# EAGLE design usbprog_v3_3 (EAGLE 5.11)
OC_FARNELL: unknown
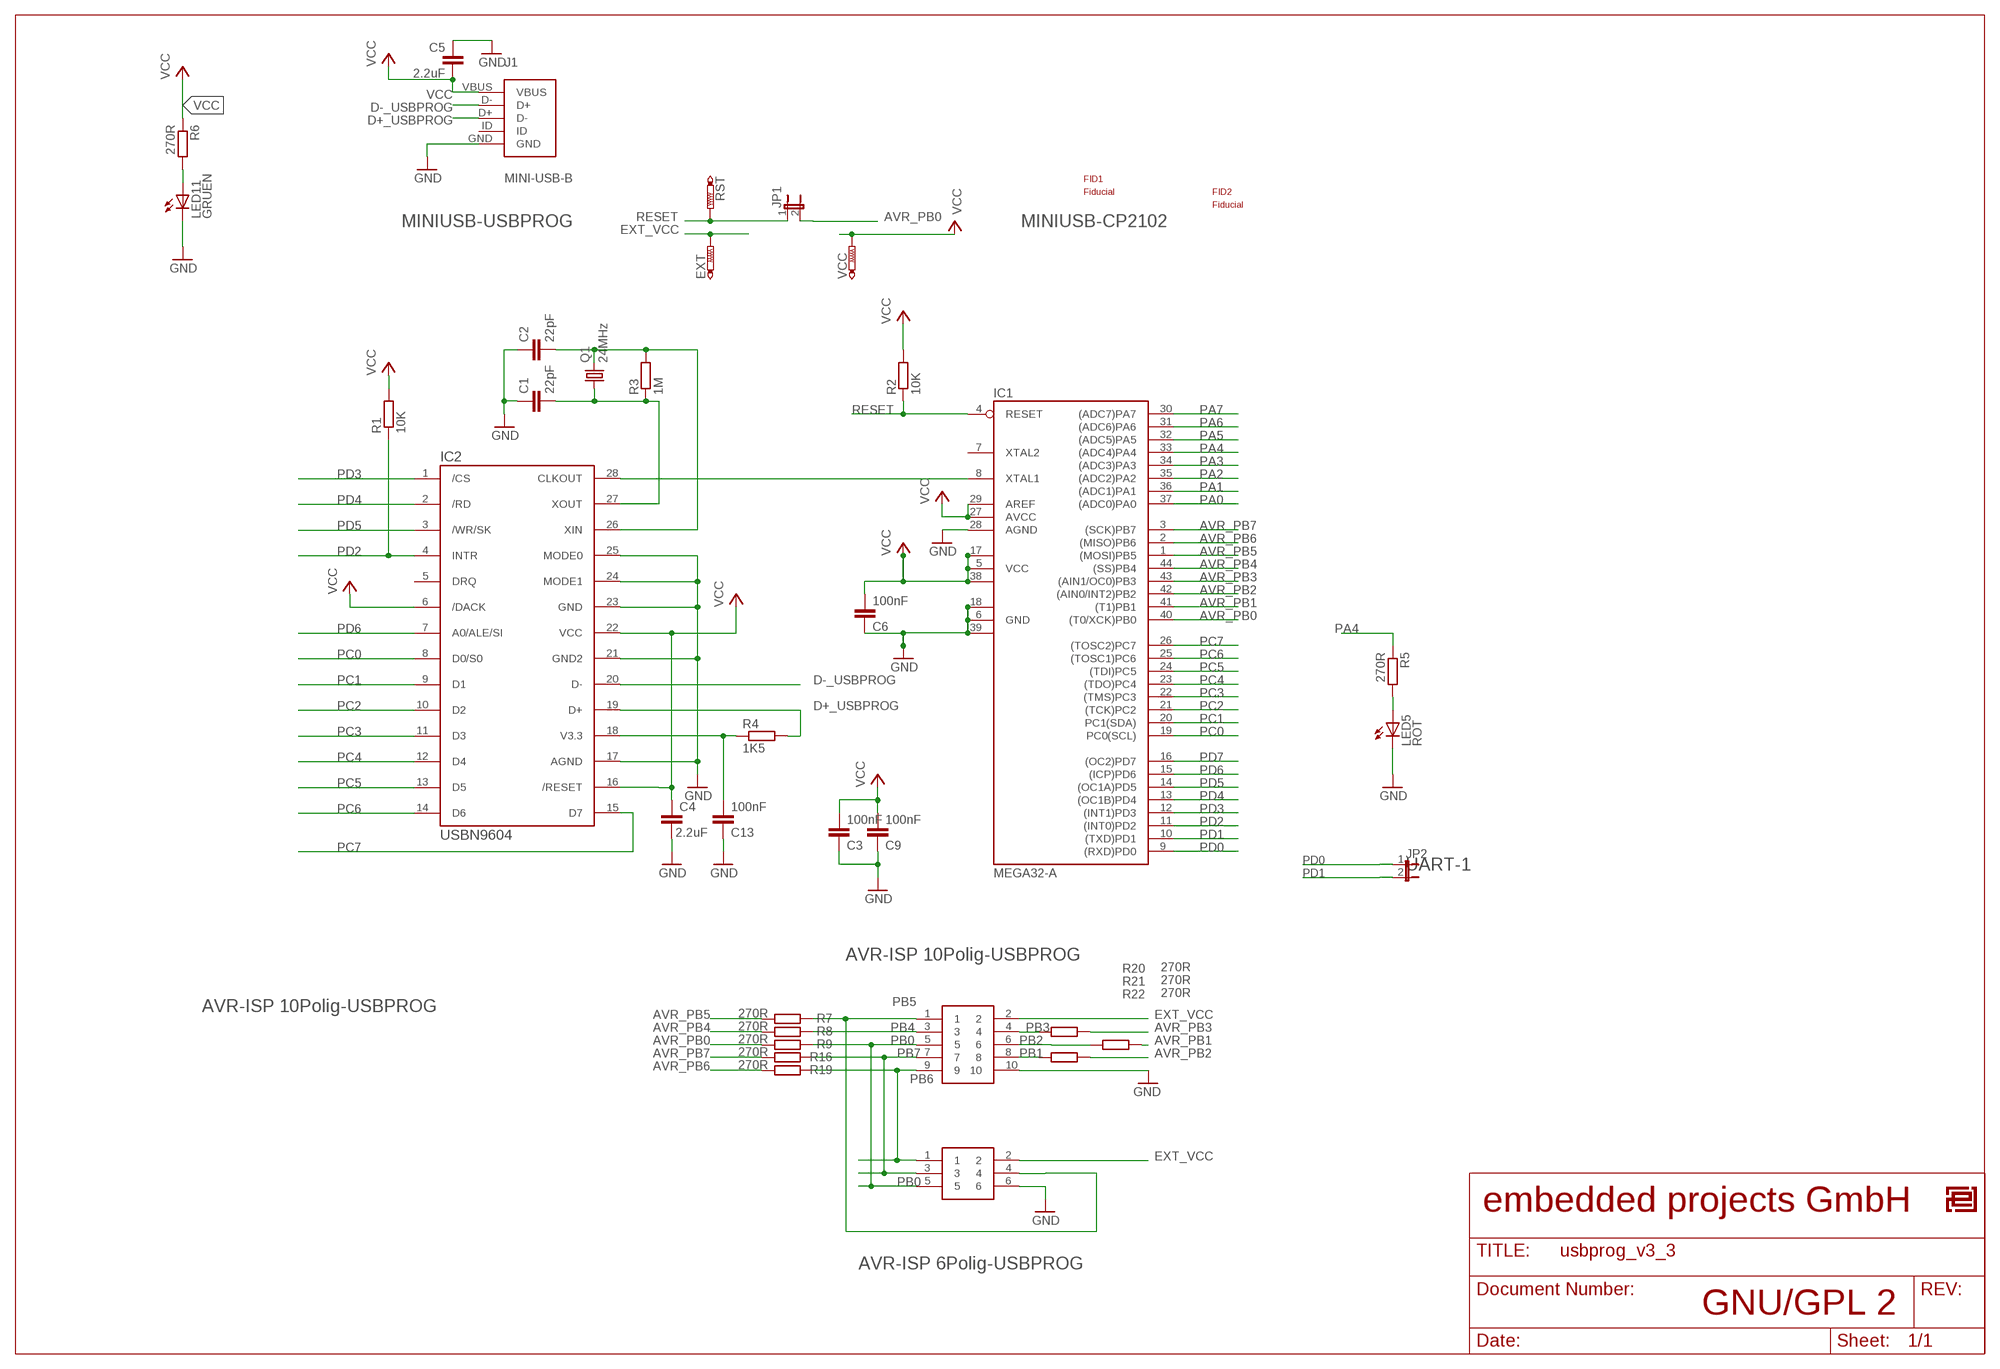
[diagram p0: schematic, sheet 1]

## Parts
C1  22pF  C-EUC0805  [C0805]
C2  22pF  C-EUC0805  [C0805]
C3  100nF  C-EUC0805  [C0805]
C4  2.2uF  C-EUC0805  [C0805]
C5  2.2uF  C-EUC0805  [C0805]
C6  100nF  C-EUC0805  [C0805]
C9  100nF  C-EUC0805  [C0805]
C13  100nF  C-EUC0805  [C0805]
EXT  PTR1TP08R  [TP08R]
FID1  PASSERMARKEN_FIDUCIAL  [PASSERMARKEN_FIDUCIAL]
FID2  PASSERMARKEN_FIDUCIAL  [PASSERMARKEN_FIDUCIAL]
IC1  MEGA32-A  [TQFP44]
IC2  USBN9604  [SO28-3]
J1  MINI-USB-B  [MINI-USB-B]
JP1  JP1E  [JP1]
JP2  JP1E  [JP1]
LED5  ROT  LEDCHIPLED_0805  [CHIPLED_0805]
LED11  GRUEN  LEDCHIPLED_0805  [CHIPLED_0805]
Q1  24MHz  CRYSTALSMD  [HC49UP]
R1  10K  R-EU_R0805  [R0805]
R2  10K  R-EU_R0805  [R0805]
R3  1M  R-EU_R0805  [R0805]
R4  1K5  R-EU_M0805  [M0805]
R5  270R  R-EU_R0805  [R0805]
R6  270R  R-EU_R0805  [R0805]
R7  270R  R-EU_R0805  [R0805]
R8  270R  R-EU_R0805  [R0805]
R9  270R  R-EU_R0805  [R0805]
R16  270R  R-EU_R0805  [R0805]
R19  270R  R-EU_R0805  [R0805]
R20  270R  R-EU_R0805  [R0805]
R21  270R  R-EU_R0805  [R0805]
R22  270R  R-EU_R0805  [R0805]
RST  PTR1TP15R  [TP15R]
U$1  EPLOGO  [EPLOGOKUPFER]
VCC  PTR1TP08R  [TP08R]
Y1  DNP  HEADER2X5  [CON-3M_PAK100/2500-10]
Y2  DNP  HEADER2X3  [PINHEADER2X3_PINHEADER3X2]

## Nets
AVR_PB0: IC1.40((T0/XCK)PB0) JP1.2 R9.2
AVR_PB1: IC1.41((T1)PB1) R21.2
AVR_PB2: IC1.42((AIN0/INT2)PB2) R22.2
AVR_PB3: IC1.43((AIN1/OC0)PB3) R20.2
AVR_PB4: IC1.44((SS)PB4) R8.2
AVR_PB5: IC1.1((MOSI)PB5) R7.2
AVR_PB6: IC1.2((MISO)PB6) R19.2
AVR_PB7: IC1.3((SCK)PB7) R16.2
D+_USBPROG: IC2.19(D+) J1.D+(D-) R4.2
D-_USBPROG: IC2.20(D-) J1.D-(D+)
EXT_VCC [500mA]: EXT.TP Y1.2 Y2.2
GND: C1.1 C2.1 C3.1 C4.2 C5.1 C6.1 C9.1 C13.1 IC1.6(GND) IC1.18(GND1) IC1.28(AGND) IC1.39(GND2) IC2.17(AGND) IC2.21(GND2) IC2.23(GND) IC2.24(MODE1) IC2.25(MODE0) J1.GND LED5.C LED11.C Y1.10 Y2.6
N$6: IC1.8(XTAL1) IC2.28(CLKOUT)
N$7: C13.2 IC2.18(V3.3) R4.1
N$8: C2.2 IC2.26(XIN) Q1.2 R3.2
N$9: LED5.A R5.2
N$10: LED11.A R6.2
N$11: C1.2 IC2.27(XOUT) Q1.1 R3.1
PA0: IC1.37((ADC0)PA0)
PA1: IC1.36((ADC1)PA1)
PA2: IC1.35((ADC2)PA2)
PA3: IC1.34((ADC3)PA3)
PA4: IC1.33((ADC4)PA4) R5.1
PA5: IC1.32((ADC5)PA5)
PA6: IC1.31((ADC6)PA6)
PA7: IC1.30((ADC7)PA7)
PB0: R9.1 Y1.5 Y2.5
PB1: R22.1 Y1.8
PB2: R21.1 Y1.6
PB3: R20.1 Y1.4
PB4: R8.1 Y1.3
PB5: R7.1 Y1.1 Y2.4
PB6: R19.1 Y1.9 Y2.1
PB7: R16.1 Y1.7 Y2.3
PC0: IC1.19(PC0(SCL)) IC2.8(D0/S0)
PC1: IC1.20(PC1(SDA)) IC2.9(D1)
PC2: IC1.21((TCK)PC2) IC2.10(D2)
PC3: IC1.22((TMS)PC3) IC2.11(D3)
PC4: IC1.23((TDO)PC4) IC2.12(D4)
PC5: IC1.24((TDI)PC5) IC2.13(D5)
PC6: IC1.25((TOSC1)PC6) IC2.14(D6)
PC7: IC1.26((TOSC2)PC7) IC2.15(D7)
PD0: IC1.9((RXD)PD0) JP2.1
PD1: IC1.10((TXD)PD1) JP2.2
PD2: IC1.11((INT0)PD2) IC2.4(INTR) R1.1
PD3: IC1.12((INT1)PD3) IC2.1(/CS)
PD4: IC1.13((OC1B)PD4) IC2.2(/RD)
PD5: IC1.14((OC1A)PD5) IC2.3(/WR/SK)
PD6: IC1.15((ICP)PD6) IC2.7(A0/ALE/SI)
PD7: IC1.16((OC2)PD7)
RESET: IC1.4(RESET) JP1.1 R2.1 RST.TP
VCC [500mA]: C3.2 C4.1 C5.2 C6.2 C9.2 IC1.5(VCC) IC1.17(VCC1) IC1.27(AVCC) IC1.29(AREF) IC1.38(VCC2) IC2.6(/DACK) IC2.16(/RESET) IC2.22(VCC) J1.VBUS R1.2 R2.2 R6.1 VCC.TP
Unconnected: IC1.7(XTAL2) IC2.5(DRQ) J1.ID

## Notes on the sheet
- MINIUSB-CP2102
- MINIUSB-USBPROG
- UART-1
- AVR-ISP 10Polig-USBPROG
- AVR-ISP 10Polig-USBPROG
- embedded projects GmbH
- AVR-ISP 6Polig-USBPROG
- GNU/GPL 2

## Library data of the parts
C1 C2 C4 C5 = rcl:C-EU: CAPACITOR, European symbol
C3 C6 C9 C13 = resistor:C-EU: CAPACITOR, European symbol
EXT RST VCC = testpad:PTR1: TEST PIN
FID1 FID2 = PASSERMARKER:PASSERMARKEN_FIDUCIAL: SMD Passermarke
IC1 = avr:MEGA32: MICROCONTROLLER 32 Kbytes FLASH 2 Kbytes SRAM 1 Kbytes EEPROM USART 8-channel 10 bit ADC
IC2 = bene:USBN9604
J1 = mini-usb-b:MINI-USB-B
JP1 JP2 = jumper:JP1E: JUMPER
LED5 LED11 = led:LED: LED OSRAM: - CHIPLED LG R971, LG N971, LY N971, LG Q971, LY Q971, LO R971, LY R971 LH N974, LH R974 LS Q976, LO Q976, LY Q976 LO Q996 - Hyper CHIPLED LW Q18S LB Q993, LB Q99A, LB R99A - SideLED LS A670, LO A670, LY A670, LG A670, LP A670 LB A673, LV A673, LT A673, LW A673 LH A674 LY A675 LS A676, LA A676, LO A676, LY A676, LW A676 LS A679, LY A679, LG A679 - Hyper Micro SIDELED® LS Y876, LA Y876, LO Y876, LY Y876 LT Y87S - SmartLED LW L88C, LW L88S LB L89C, LB L89S, LG L890 LS L89K, LO L89K, LY L89K LS L896, LA L896, LO L896, LY L896 - TOPLED LS T670, LO T670, LY T670, LG T670, LP T670 LSG T670, LSP T670, LSY T670, LOP T670, LYG T670 LG T671, LOG T671, LSG T671 LB T673, LV T673, LT T673, LW T673 LH T674 LS T676, LA T676, LO T676, LY T676, LB T676, LH T676, LSB T676, LW T676 LB T67C, LV T67C, LT T67C, LS T67K, LO T67K, LY T67K, LW E67C LS E67B, LA E67B, LO E67B, LY E67B, LB E67C, LV E67C, LT E67C LW T67C LS T679, LY T679, LG T679 LS T770, LO T770, LY T770, LG T770, LP T770 LB T773, LV T773, LT T773, LW T773 LH T774 LS E675, LA E675, LY E675, LS T675 LS T776, LA T776, LO T776, LY T776, LB T776 LHGB T686 LT T68C, LB T68C - Hyper Mini TOPLED® LB M676 - Mini TOPLED Santana® LG M470 LS M47K, LO M47K, LY M47K Source: http://www.osram.convergy.de LUXEON: - LUMILED® LXK2-PW12-R00, LXK2-PW12-S00, LXK2-PW14-U00, LXK2-PW14-V00 LXK2-PM12-R00, LXK2-PM12-S00, LXK2-PM14-U00 LXK2-PE12-Q00, LXK2-PE12-R00, LXK2-PE12-S00, LXK2-PE14-T00, LXK2-PE14-U00 LXK2-PB12-K00, LXK2-PB12-L00, LXK2-PB12-M00, LXK2-PB14-N00, LXK2-PB14-P00, LXK2-PB14-Q00 LXK2-PR12-L00, LXK2-PR12-M00, LXK2-PR14-Q00, LXK2-PR14-R00 LXK2-PD12-Q00, LXK2-PD12-R00, LXK2-PD12-S00 LXK2-PH12-R00, LXK2-PH12-S00 LXK2-PL12-P00, LXK2-PL12-Q00, LXK2-PL12-R00 Source: www.luxeon.com KINGBRIGHT: KA-3528ASYC Source: www.kingbright.com
Q1 = SparkFun:CRYSTAL: Crystals Various standard crystals. Proven footprints. Spark Fun Electronics SKU : COM-00534
R1-R9 R16 R19-R22 = rcl:R-EU_: RESISTOR, European symbol
U$1 = EmbeddedProjectsLogos2:EPLOGO
Y1 = usbprog:HEADER2X5
Y2 = usbprog:HEADER2X3

## Net classes
0 default: width 0.203 mm, drill 0.7 mm, clearance 0.203 mm
1 500mA: width 0.203 mm, drill 0.7 mm, clearance 0.203 mm
2 CP2102: width 0.203 mm, drill 0.7 mm, clearance 0.203 mm

## Board
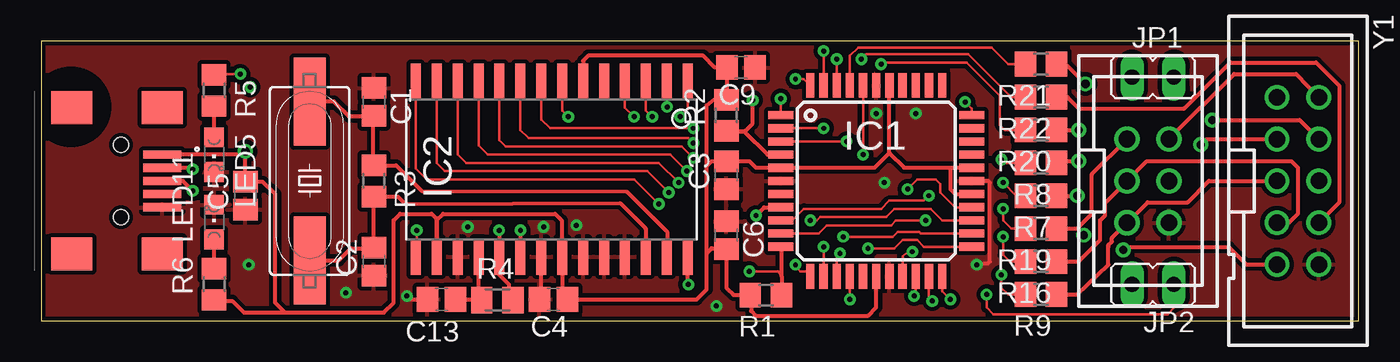
[diagram p1: board, top side]
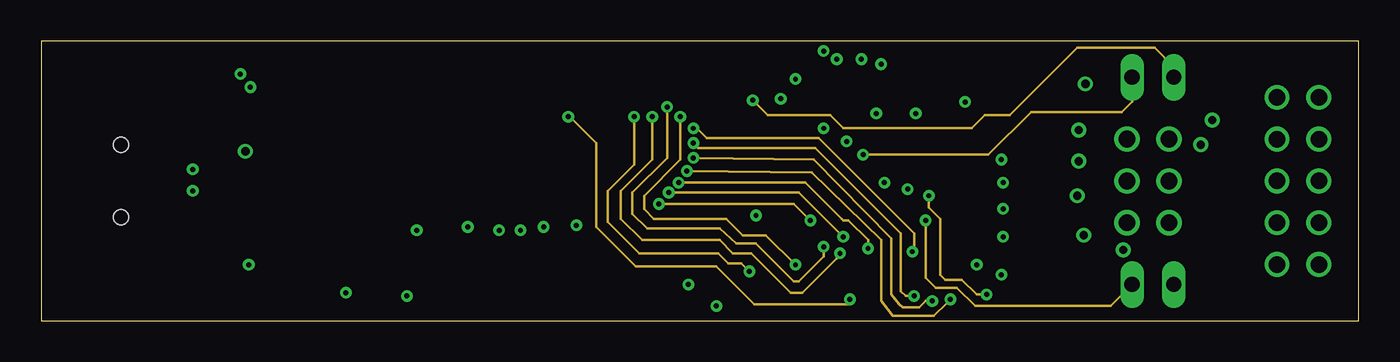
[diagram p2: board, inner layer Route2]
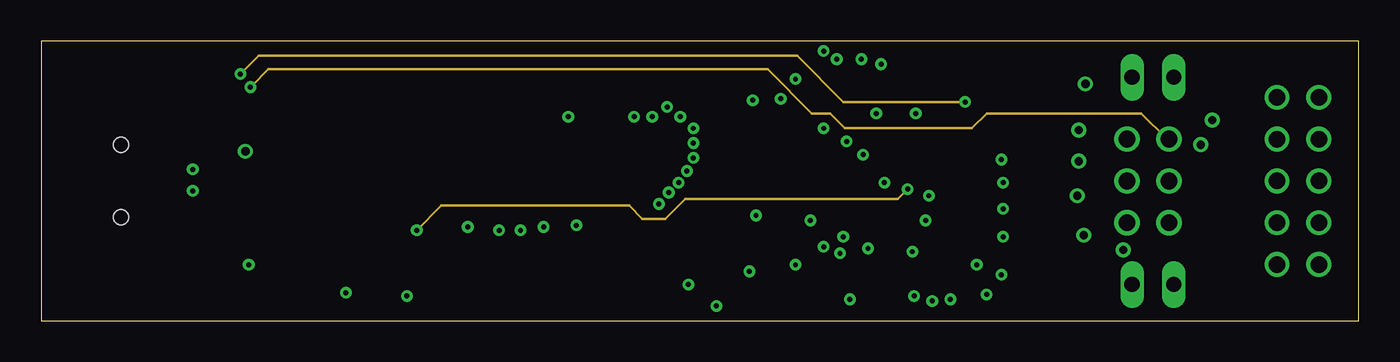
[diagram p3: board, inner layer Route3]
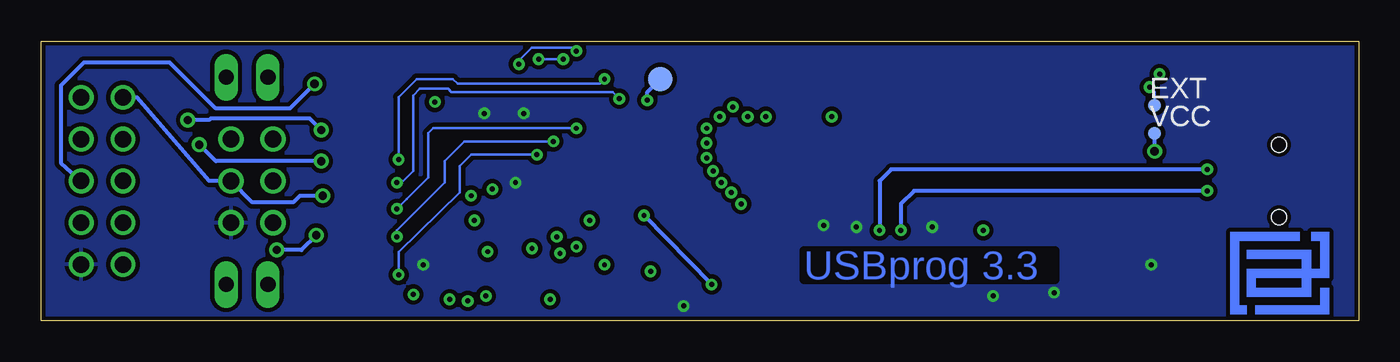
[diagram p4: board, bottom side, seen from below]

Size 80 x 17 mm. Coordinates in mm from the lower left corner, seen from the top.
Outline: 0,0 80,0 80,17 0,17 0,0
Copper layers (1*2+3*16): Top 0.035mm / dielectric 1.5mm / Route2 0.035mm / dielectric 0.15mm / Route3 0.035mm / dielectric 0.2mm / Bottom 0.035mm
Design rules "8mils *": minimum track width 8mil, minimum drill 0.6mm, track to track 10mil, track to pad 10mil, pad to pad 10mil, via to via 10mil, smd to smd 0mil, copper to edge 10mil, drill to drill 10mil, minimum pad ring 10mil, minimum via ring 8mil, stop-mask expansion 0mil, vias tented up to drill 40mil, thermal gap 10mil

### Footprints (pad centres in the part's own frame; a part is rotated, then mirrored left to right if it is on the bottom)
C0805 = smd 1.3 x 1.5: 1 -0.85,0; 2 0.85,0
TP08R = smd 0.8 x 0.8: TP 0,0
PASSERMARKEN_FIDUCIAL = smd 1.27 x 1.27: 1 0,0
TQFP44 = smd 1.5 x 0.5: 1 -5.8,4; 2 -5.8,3.2; 3 -5.8,2.4; 4 -5.8,1.6; 5 -5.8,0.8; 6 -5.8,0; 7 -5.8,-0.8; 8 -5.8,-1.6; 9 -5.8,-2.4; 10 -5.8,-3.2; 11 -5.8,-4; 23 5.8,-4; 24 5.8,-3.2; 25 5.8,-2.4; 26 5.8,-1.6; 27 5.8,-0.8; 28 5.8,0; 29 5.8,0.8; 30 5.8,1.6; 31 5.8,2.4; 32 5.8,3.2; 33 5.8,4 | smd 0.5 x 1.5: 12 -4,-5.8; 13 -3.2,-5.8; 14 -2.4,-5.8; 15 -1.6,-5.8; 16 -0.8,-5.8; 17 0,-5.8; 18 0.8,-5.8; 19 1.6,-5.8; 20 2.4,-5.8; 21 3.2,-5.8; 22 4,-5.8; 34 4,5.8; 35 3.2,5.8; 36 2.4,5.8; 37 1.6,5.8; 38 0.8,5.8; 39 0,5.8; 40 -0.8,5.8; 41 -1.6,5.8; 42 -2.4,5.8; 43 -3.2,5.8; 44 -4,5.8
SO28-3 = smd 0.61 x 2.21: 1 -8.255,-5.315; 2 -6.985,-5.315; 3 -5.715,-5.315; 4 -4.445,-5.315; 5 -3.175,-5.315; 6 -1.905,-5.315; 7 -0.635,-5.315; 8 0.635,-5.315; 9 1.905,-5.315; 10 3.175,-5.315; 11 4.445,-5.315; 12 5.715,-5.315; 13 6.985,-5.315; 14 8.255,-5.315; 15 8.255,5.315; 16 6.985,5.315; 17 5.715,5.315; 18 4.445,5.315; 19 3.175,5.315; 20 1.905,5.315; 21 0.635,5.315; 22 -0.635,5.315; 23 -1.905,5.315; 24 -3.175,5.315; 25 -4.445,5.315; 26 -5.715,5.315; 27 -6.985,5.315; 28 -8.255,5.315
MINI-USB-B = smd 2.3 x 0.5: D+ -7.75,0; D- -7.75,-0.8; GND -7.75,1.6; ID -7.75,0.8; VBUS -7.75,-1.6 | smd 2.5 x 2: PAD1 -7.75,-4.45; PAD2 -7.75,4.45; PAD3 -2.25,4.45; PAD4 -2.25,-4.45 | hole 0.9: -5.25,2.2; -5.25,-2.2
JP1 = drill 0.914 long: 1 0,-1.27; 2 0,1.27
CHIPLED_0805 = smd 1.2 x 1.2: A 0,-1.05; C 0,1.05
HC49UP = smd 5.334 x 1.93: 1 -4.826,0; 2 4.826,0
R0805 = smd 1.3 x 1.5: 1 -0.95,0; 2 0.95,0
M0805 = smd 1.3 x 1.6: 1 -0.95,0; 2 0.95,0
TP15R = smd 1.5 x 1.5: TP 0,0
CON-3M_PAK100/2500-10 = drill 1 pad 1.422 round: 1 -5.08,-1.27; 2 -5.08,1.27; 3 -2.54,-1.27; 4 -2.54,1.27; 5 0,-1.27; 6 0,1.27; 7 2.54,-1.27; 8 2.54,1.27; 9 5.08,-1.27; 10 5.08,1.27
PINHEADER2X3_PINHEADER3X2 = drill 1.02 round: 1 -1.27,2.54; 2 1.27,2.54; 3 -1.27,0; 4 1.27,0; 5 -1.27,-2.54; 6 1.27,-2.54

### Placement (x,y rotation side)
C1  20.2,13.3 270 top
C2  20.2,3.6 90 top
C3  41.6,8.85 90 top
C4  31.1,1.3 180 top
C5  12.4,7.6 90 top
C6  41.6,5.2 270 top
C9  42.5,15.4 180 top
C13  24.3,1.3 0 top
EXT  12.4,13.1 0 bottom
FID1  1.8,13 0 top
FID2  61.65,1.62 0 top
IC1  50.7,8.5 0 top
IC2  31,9.2 180 top
J1  -0.4,8.5 180 top
JP1  67.5,14.8 90 top
JP2  67.5,2.2 90 top
LED5  10.5,10.1 180 top
LED11  10.5,6 0 top
Q1  16.3,8.5 270 top
R1  44,1.56 180 top
R2  41.6,12.49 90 top
R3  20.2,8.5 270 top
R4  27.7,1.26 0 top
R5  10.5,14 270 top
R6  10.5,2.22 90 top
R7  60.7,7.6 180 top
R8  60.7,9.6 180 top
R9  60.7,1.6 180 top
R16  60.7,3.6 180 top
R19  60.7,5.6 180 top
R20  60.7,11.6 180 top
R21  60.7,15.6 180 top
R22  60.7,13.6 180 top
RST  42.4,14.7 180 bottom
U$1  1.8,5.4 180 bottom
VCC  12.4,11.4 0 bottom
Y1  76.3,8.5 270 top
Y2  67.2,8.5 0 top

### Tracks (layer width: path | path; a pad name or v marks a point on that pad's centre or on a via)
AVR_PB0  (via drill 0.3)
  Top 0.15: R9.2 58.7,1.6 58.3,2 v58.3,2.8 | v49.9,10.1 IC1.40
  Route2 0.15: JP1.2 66.23,13.33 65.6,12.7 60.1,12.7 57.5,10.1 50.1,10.1 v49.9,10.1
  Bottom 0.15: v58.3,2.8 58.3,4.2 54.6,7.8 54.6,9.4 53.9,10.1 v49.9,10.1
AVR_PB1
  Top 0.15: R21.2 58.7,15.6 57.7,16.6 49.6,16.6 49.1,16.1 IC1.41
AVR_PB2  (via drill 0.3)
  Top 0.15: R22.2 58.9,13.6 56.3,16.2 50.1,16.2 v49.8,15.9 | IC1.42 v48.3,15.9
  Bottom 0.15: v48.3,15.9 v49.8,15.9
AVR_PB3  (via drill 0.3)
  Top 0.15: R20.2 58.5,11.6 58.2,11.9 58.2,13.7 56.2,15.7 51.1,15.7 v51,15.6 | IC1.43 v47.5,16.4
  Bottom 0.15: v51,15.6 51,15.8 50.2,16.6 47.7,16.6 v47.5,16.4
AVR_PB4  (via drill 0.3)
  Top 0.15: R8.2 58.5,9.6 v58.3,9.8 | v45.8,14.7 46.3,14.7 IC1.44
  Bottom 0.15: v58.3,9.8 58.3,13.6 57.2,14.7 55,14.7 54.7,14.4 46.1,14.4 v45.8,14.7
AVR_PB5  (via drill 0.3)
  Top 0.15: R7.2 59.2,7.6 v58.4,8.4 | IC1.1 v44.9,13.5
  Bottom 0.15: v58.4,8.4 58.1,8.4 57.4,9.1 57.4,13.7 57,14.1 55.3,14.1 55.1,13.9 45.3,13.9 v44.9,13.5
AVR_PB6  (via drill 0.3)
  Top 0.15: R19.2 58.9,5.6 58.4,6.1 v58.4,6.8 | IC1.2 v47.5,11.7
  Bottom 0.15: v58.4,6.8 57.8,7.4 56.5,8.7 56.5,11.4 56.2,11.7 v47.5,11.7
AVR_PB7  (via drill 0.3)
  Top 0.15: R16.2 58.8,3.6 58.4,4 v58.4,5.1 | IC1.3 v48.9,10.9
  Bottom 0.15: v58.4,5.1 58.4,5.5 55.5,8.4 55.5,9.7 54.3,10.9 v48.9,10.9
D+_USBPROG  (via drill 0.3)
  Top 0.254: R4.2 28.4,1.31 28.4,2.2 27.82,2.77 IC2.19 27.8,3.91 v27.8,5.5 | J1.D+ 8.6,8.5 v9.2,7.9
  Bottom 0.254: v9.2,7.9 27,7.9 27.8,7.1 v27.8,5.5
D-_USBPROG  (via drill 0.3)
  Top 0.254: J1.D- 9.1,9.3 v9.2,9.2 | v29.1,5.5 IC2.20
  Bottom 0.254: v9.2,9.2 28.4,9.2 29.1,8.5 v29.1,5.5
EXT_VCC  (via drill 0.3)
  Top 0.254: Y1.2 76.2,15 72.43,15 Y2.2
  Route3 0.15: Y2.2 68.36,11.04 66.8,12.6 57.4,12.6 56.5,11.7 48.8,11.7 47.9,12.6 46.8,12.6 44.1,15.3 13.8,15.3 12.8,14.3 v12.7,14.2
  Bottom 0.15: v12.7,14.2 12.4,13.9 EXT.TP
GND  (via drill 0.3)
  Top 0.254: IC2.21 30.36,1.51 C4.2 | IC1.28 57.5,8.5 57.6,8.4 57.6,3.6 57.5,3.5 56.9,3.5 v56.8,3.4 | C13.1 22.3,1.3 22.1,1.5 v22.2,1.5
  other vias: 12.6,3.4 18.5,1.7 25.9,5.7 32.5,5.8 30.5,5.7 51.2,8.4 50.7,12.6 53.1,12.6 41,0.9
  pour Top: 81,-0.7 -0.6,-0.7 -0.6,17.7 81,17.7
  pour Bottom: 80.6,17.9 -0.6,17.9 -0.6,-0.6 80.6,-0.6
N$6  (via drill 0.3)
  Top 0.254: IC2.28 39.26,2.25 v39.3,2.2 | v43.4,6.4 43.9,6.9 IC1.8
  Bottom 0.254: v39.3,2.2 v43.4,6.4
N$7
  Top 0.254: C13.2 26.51,1.3 R4.1 26.55,1.26 IC2.18
N$8
  Top 0.254: Q1.2 18.07,3.67 18.8,4.4 20.25,4.4 C2.2 R3.2 21.65,7.55 22.1,7.1 35.15,7.15 36.7,5.6 36.7,3.9 IC2.26
N$9
  Top 0.254: LED5.A R5.2
N$10
  Top 0.254: R6.2 LED11.A
N$11
  Top 0.254: Q1.1 17.77,13.33 18.7,12.4 20.15,12.4 | 20.15,12.4 C1.2 | 20.15,12.4 20.15,9.5 R3.1 21.55,9.45 23.1,7.9 35.55,7.85 38,5.4 38,3.9 IC2.27
PA4  (via drill 0.3)
  Top 0.15: IC1.33 56.5,12.9 v56.1,13.3 | v12.1,15 10.55,15 R5.1
  Route3 0.15: v56.1,13.3 48.7,13.3 45.9,16.1 13.2,16.1 v12.1,15
PB0
  Top 0.254: R9.1 62.9,1.6 64.8,3.4 64.8,4.5 64.8,4.6 65,4.8 65,5.03 Y2.5 67.17,7.2 69.6,7.2 70.9,8.5 Y1.5
PB1
  Top 0.254: R22.1 62.3,13.6 63,12.9 69.4,12.9 72.2,15.7 77.4,15.7 78.8,14.3 78.8,7.19 Y1.8
PB2  (via drill 0.5)
  Top 0.254: v63.4,14.4 62.3,15.5 61.75,15.5 R21.1
  Bottom 0.254: Y1.6 77.6,8.5 78.8,9.6 78.8,14.3 77.4,15.7 72.2,15.7 69.4,12.9 64.9,12.9 v63.4,14.4
PB3  (via drill 0.5)
  Top 0.254: Y1.4 76.4,12.2 v71.1,12.2 | R20.1 v63,11.6
  Bottom 0.254: v71.1,12.2 69.8,12.2 69.7,12.3 63.7,12.3 v63,11.6
PB4  (via drill 0.5)
  Top 0.254: Y1.3 70.74,11.04 v70.4,10.7 | v63,9.7 61.75,9.7 R8.1
  Bottom 0.254: v70.4,10.7 69.4,9.7 v63,9.7
PB5  (via drill 0.5)
  Top 0.254: R7.1 v62.9,7.6
  Bottom 0.254: Y1.1 74.18,13.58 69.8,8.5 69.57,8.5 Y2.4 67.17,7.2 64.7,7.2 64.3,7.6 v62.9,7.6
PB6  (via drill 0.5)
  Top 0.254: R19.1 62.9,5.6 | 62.9,5.6 63.8,6.5 63.8,8.91 Y2.1 | Y1.9 73.18,3.42 72.1,4.5 65.9,4.5 v65.7,4.3 | 62.9,5.6 v63.3,5.2
  Bottom 0.254: v65.7,4.3 64.2,4.3 v63.3,5.2
PB7
  Top 0.254: R16.1 63,3.6 64.3,4.9 64.3,6 64.3,6.1 64.6,6.4 64.6,7.17 Y2.3 67.13,9.7 75.9,9.7 76.3,9.3 76.3,6.5 75.76,5.96 Y1.7
PC0  (via drill 0.3)
  Top 0.15: IC2.8 30.36,12.23 30.9,11.7 v39.6,11.7 | v52.9,4.2 52.6,4.2 52.3,3.9 IC1.19
  Route2 0.15: v39.6,11.7 39.8,11.7 40.4,11.1 47,11.1 47.2,11.1 53,5.3 53,4.3 v52.9,4.2
PC1  (via drill 0.3)
  Top 0.15: IC2.9 29.09,11.61 29.6,11.1 39.3,11.1 v39.6,10.8 | v53,1.5 53.1,1.6 IC1.20
  Route2 0.15: v39.6,10.8 39.9,10.5 47,10.5 52.2,5.3 52.2,1.8 52.5,1.5 v53,1.5
PC2  (via drill 0.3)
  Top 0.15: IC2.10 27.82,10.97 28.2,10.6 38.9,10.6 v39.6,9.9 | IC1.21 53.9,1.4 v54.1,1.2
  Route2 0.15: v39.6,9.9 46.9,9.8 51.6,5 51.6,1.6 52.1,1 52.3,0.8 53.3,0.8 53.7,1.2 v54.1,1.2
PC3  (via drill 0.3)
  Top 0.15: IC2.11 26.55,10.64 27.1,10.1 38.2,10.1 v39.2,9.1 | v55.2,1.3 54.7,1.8 IC1.22
  Route2 0.15: v39.2,9.1 46.8,9 51,4.9 51,1.2 51.7,0.3 54.2,0.3 55,1.1 v55.2,1.3
PC4  (via drill 0.3)
  Top 0.15: IC2.12 25.29,10.12 25.8,9.6 37.5,9.6 v38.7,8.4 | v50.2,4.4 51.8,4.4 52.3,4.9 53.2,4.9 53.6,4.5 IC1.23
  Route2 0.15: v38.7,8.4 46.4,8.4 48.6,6.2 48.7,6.1 49,6.1 50.2,4.9 v50.2,4.4
PC5  (via drill 0.3)
  Top 0.15: IC2.13 24.02,9.59 24.5,9.1 36.8,9.1 v38.1,7.8 | v48.7,5.1 51.7,5.1 52,5.4 53.3,5.4 53.4,5.3 53.9,5.3 IC1.24
  Route2 0.15: v38.1,7.8 46,7.8 v48.7,5.1
PC6  (via drill 0.3)
  Top 0.15: IC2.14 22.75,9.26 23.4,8.6 36,8.6 v37.5,7.1 | v46.7,6.1 47.1,6.1 47.3,6.3 51.3,6.3 51.8,6.8 54,6.8 54.7,6.1 IC1.25
  Route2 0.15: v37.5,7.1 45.7,7.1 v46.7,6.1
PC7  (via drill 0.3)
  Top 0.15: IC1.26 55.5,6.9 54.6,7.8 54.6,8.3 54.3,8.6 53.2,8.6 v52.6,8 | v22.8,5.5 22.8,3.94 IC2.15
  Route3 0.15: v52.6,8 52,7.4 39.1,7.4 37.9,6.2 36.5,6.2 35.7,7 24.3,7 v22.8,5.5
PD0  (via drill 0.3)
  Top 0.15: IC1.9 45.6,6.1 46.3,6.8 51,6.8 51.5,7.3 53.6,7.3 v53.9,7.6 | v57.4,1.6 57.4,0.8 57.8,0.4 68.4,0.4 68.8,0.8 68.8,2.17 JP2.1
  Route2 0.15: v53.9,7.6 53.9,6.9 54.6,6.2 54.6,2.8 54.9,2.5 55.9,2.5 56.8,1.6 57,1.6 v57.4,1.6
PD1  (via drill 0.3)
  Top 0.15: IC1.10 47.2,5.3 47.7,5.8 51.6,5.8 51.9,6.1 53.6,6.1 v53.7,6.1
  Route2 0.15: v53.7,6.1 53.7,2.6 54.3,2 55.6,2 56.7,0.9 64.93,0.9 JP2.2
PD2  (via drill 0.3)
  Top 0.15: IC2.4 35.45,12.96 v36,12.4 | v43,3 44.75,3 44.95,2.7
  Top 0.254: R1.1 44.95,2.7 44.95,4.45 IC1.11
  Route2 0.15: v36,12.4 36,9.5 34.4,7.9 34.4,6 36.3,4.1 41.1,4.1 41.7,3.5 42.5,3.5 v43,3
PD3  (via drill 0.3)
  Top 0.15: IC2.1 39.26,12.86 v38.8,12.4 | v45.8,3.4 45.8,3.3 46.1,3 46.4,3 IC1.12
  Route2 0.15: v38.8,12.4 38.8,9.8 36.6,7.6 36.6,6.8 37.2,6.2 41.6,6.2 42.6,5.2 44,5.2 v45.8,3.4
PD4  (via drill 0.3)
  Top 0.15: IC2.2 37.98,13.02 v38,13 | v47.5,4.5 IC1.13
  Route2 0.15: v38,13 38,9.9 35.9,7.8 35.9,6.5 36.8,5.6 41.2,5.6 42.2,4.7 43.4,4.7 45.7,2.4 46,2.4 47.5,3.9 v47.5,4.5
PD5  (via drill 0.3)
  Top 0.15: IC2.3 36.72,12.79 v37.1,12.4 | v48.5,4.1 48.3,3.9 IC1.14
  Route2 0.15: v37.1,12.4 37.1,9.8 35.2,7.9 35.2,6.2 36.5,4.9 41.2,4.9 42,4.1 43.1,4.1 45.5,1.7 46.2,1.7 48.3,3.8 48.3,3.9 v48.5,4.1
PD6  (via drill 0.3)
  Top 0.15: IC2.7 31.64,12.77 v32,12.4 | v49.1,1.3 IC1.15
  Route2 0.15: v32,12.4 32.1,12.4 33.7,10.8 33.7,5.7 36.1,3.3 41,3.3 43.3,1 49,1 v49.1,1.3
RESET  (via drill 0.3)
  Top 0.254: IC1.4 44.1,10.1 42.7,11.5 41.74,11.5 R2.1 42.74,11.54 43.2,12 v43.2,13.4
  Route2 0.15: JP1.1 68.77,15.43 67.6,16.6 62.9,16.6 58.8,12.5 57.3,12.5 56.5,11.7 48.7,11.7 47.9,12.5 44.1,12.5 v43.2,13.4
  Bottom 0.254: v43.2,13.4 43.2,13.9 RST.TP
VCC  (via drill 0.5)
  Top 0.254: J1.VBUS 12.2,10.1 v12.4,10.3 C5.2 13.45,8.45 14.2,7.7 14.2,1.1 14.8,0.5 | 40.4,7.7 40.4,13.1 40.84,13.44 R2.2 41.65,13.49 C9.2 40.9,15.4 40.2,16.1 33.2,16.1 32.91,15.8 IC2.6 | 40.4,4.1 40.4,7.7 | 40.4,4.1 40.7,4.4 41.65,4.4 C6.2 41.6,2 42.04,1.56 R1.2 43.1,1.51 43.1,0.6 43.4,0.3 50.2,0.3 50.7,0.8 IC1.17 | 40.4,4.1 40.4,1.9 39.8,1.3 C4.1 31.64,1.51 IC2.22 31.6,3.92 31.6,6.1 31.2,6.5 24.4,6.5 24.02,6.12 IC2.16 24.02,6.18 23.7,6.5 21.8,6.5 21.4,6.1 21.4,1.1 20.8,0.5 14.8,0.5 | 51.5,10.2 IC1.38 | 51.5,10.2 52.4,9.3 55.2,9.3 | 55.2,9.3 IC1.29 | IC1.27 55.5,7.7 55.2,8 55.2,9.3 | 51.5,10.2 50.6,9.3 IC1.5 43.4,9.3 43,9.7 C3.2 40.7,9.7 40.4,9.4 40.4,7.7 | 14.8,0.5 12.3,0.5 11.6,1.2 10.57,1.2 R6.1
  Bottom 0.254: v12.4,10.3 VCC.TP

### Text on the board
Bottom: USBprog 3.3
tNames: ISP | USBprog 4.0 | ISP